# EAGLE design MATE_2024_float_layer_cake_footprint_v1 (EAGLE 9.6.2)
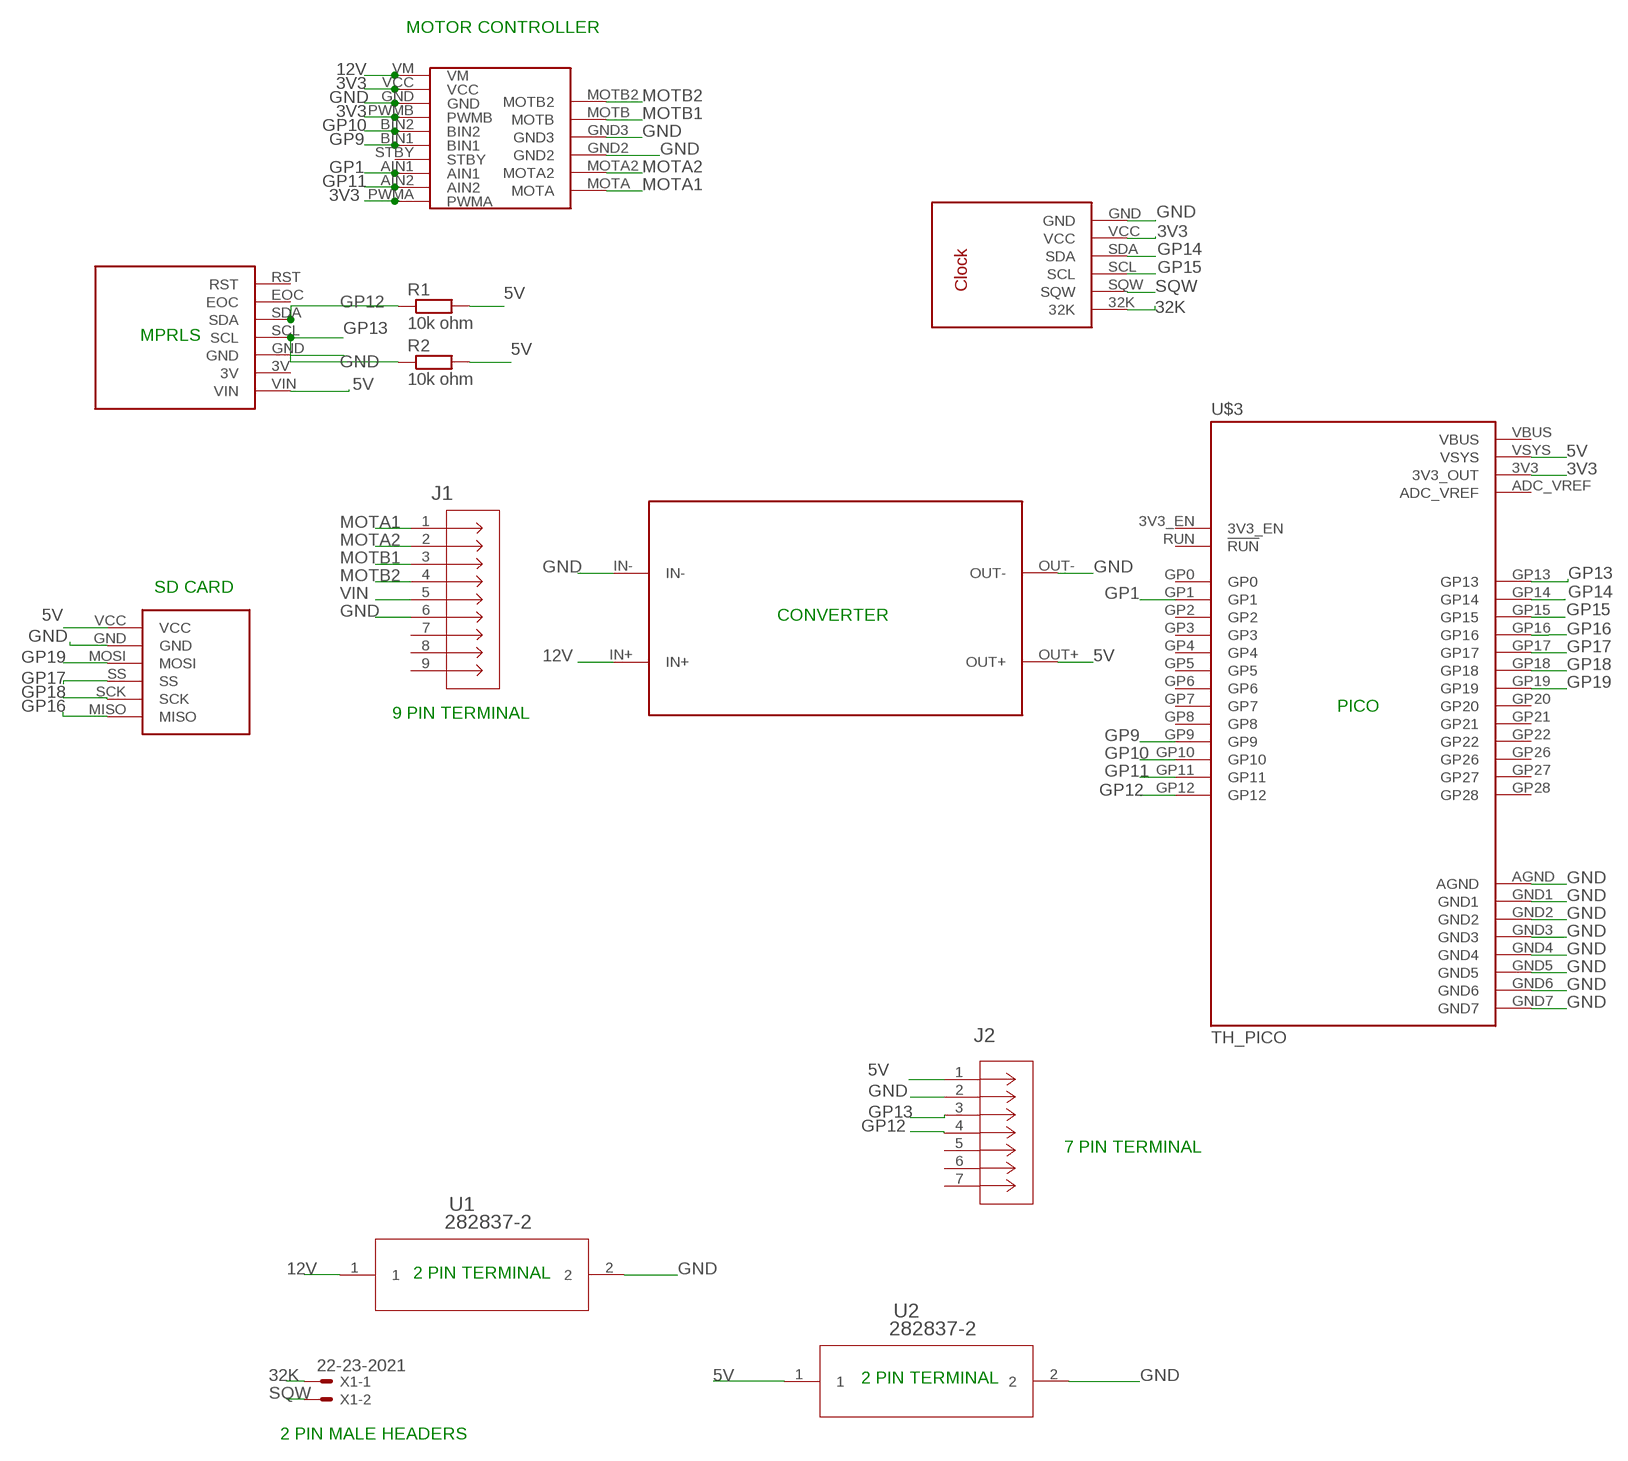
[diagram p0: schematic, sheet 1]

## Parts
J1  282837-9  [CONN9_282837-9_TEC]
J2  282837-7  [282837-7_TEC]
PRESSURE  PRESSURE  [PRESSURE]
R1  10k ohm  R-EU_0204/7  [0204/7]
R2  10k ohm  R-EU_0204/7  [0204/7]
U1  282837-2  [282837-2_TYC]
U2  282837-2  [282837-2_TYC]
U$1  CONVERTER  [CONVERTER]
U$2  STEPPERMOTOR  [STEPPERV2]
U$3  TH_PICO  [TH_PICO]
U$5  MICROSDCARD  [MICROSDCARD]
U$6  CLOCKMODULE  [CLOCKMODULE]
X1  22-23-2021  [22-23-2021]

## Nets
3V3: U$2.PWMA U$2.PWMB U$2.VCC U$3.3V3(3V3_OUT) U$6.VCC
5V: J2.1 PRESSURE.VIN R1.2 R2.2 U2.1 U$1.OUT+ U$3.VSYS U$5.VCC
12V: U1.1 U$1.IN+ U$2.VM
32K: U$6.32K X1.1
GND: J1.6 J2.2 PRESSURE.GND U1.2 U2.2 U$1.IN- U$1.OUT- U$2.GND U$2.GND2 U$2.GND3 U$3.AGND U$3.GND1 U$3.GND2 U$3.GND3 U$3.GND4 U$3.GND5 U$3.GND6 U$3.GND7 U$5.GND U$6.GND
GP1: U$2.AIN1 U$3.GP1
GP9: U$2.BIN1 U$3.GP9
GP10: U$2.BIN2 U$3.GP10
GP11: U$2.AIN2 U$3.GP11
GP12: J2.4 PRESSURE.SDA R1.1 U$3.GP12
GP13: J2.3 PRESSURE.SCL R2.1 U$3.GP13
GP14: U$3.GP14 U$6.SDA
GP15: U$3.GP15 U$6.SCL
GP16: U$3.GP16 U$5.MISO
GP17: U$3.GP17 U$5.SS
GP18: U$3.GP18 U$5.SCK
GP19: U$3.GP19 U$5.MOSI
MOTA1: J1.1 U$2.MOTA
MOTA2: J1.2 U$2.MOTA2
MOTB1: J1.3 U$2.MOTB
MOTB2: J1.4 U$2.MOTB2
SQW: U$6.SQW X1.2
VIN: J1.5
Unconnected: J1.7 J1.8 J1.9 J2.5 J2.6 J2.7 PRESSURE.3V PRESSURE.EOC PRESSURE.RST U$2.STBY U$3.3V3_EN U$3.GP0 U$3.GP2 U$3.GP3 U$3.GP4 U$3.GP5 U$3.GP6 U$3.GP7 U$3.GP8 U$3.GP20 U$3.GP21 U$3.GP22 U$3.GP26 U$3.GP27 U$3.GP28 U$3.RUN(!RUN)

## Notes on the sheet
- MOTOR CONTROLLER
- MPRLS
- SD CARD
- CONVERTER
- PICO
- 9 PIN TERMINAL
- 7 PIN TERMINAL
- 2 PIN TERMINAL
- 2 PIN TERMINAL
- 2 PIN MALE HEADERS

## Power pins joined to a net without a drawn wire
ADC_VREF: U$3.ADC_VREF
VBUS: U$3.VBUS

## Library data of the parts
J1 = float:282837-9; COPYRIGHT: Copyright (C) 2024 Ultra Librarian. All rights reserved.; MANUFACTURER_PART_NUMBER: 282837-9; MFR_NAME: TE Connectivity
J2 = float:282837-7; COPYRIGHT: Copyright (C) 2024 Ultra Librarian. All rights reserved.; MANUFACTURER_PART_NUMBER: 282837-7; MFR_NAME: TE Connectivity
PRESSURE = Pressure Sensor:PRESSURE
R1 R2 = rcl:R-EU_: RESISTOR, European symbol; SPICEPREFIX: R
U1 U2 = float:282837-2; COPYRIGHT: Copyright (C) 2024 Ultra Librarian. All rights reserved.; MANUFACTURER_PART_NUMBER: 282837-2; MFR_NAME: TE Connectivity
U$1 = float:CONVERTER
U$2 = Stepper_Motor (1):STEPPERMOTOR
U$3 = raspberryPiPico_thru-hole:TH_PICO
U$5 = SDCARD:MICROSDCARD
U$6 = Clock:CLOCKMODULE
X1 = con-molex:22-23-2021: .100" (2.54mm) Center Header - 2 Pin; MF: MOLEX; MPN: 22-23-2021; OC_FARNELL: 1462926; OC_NEWARK: 25C3832

## Board
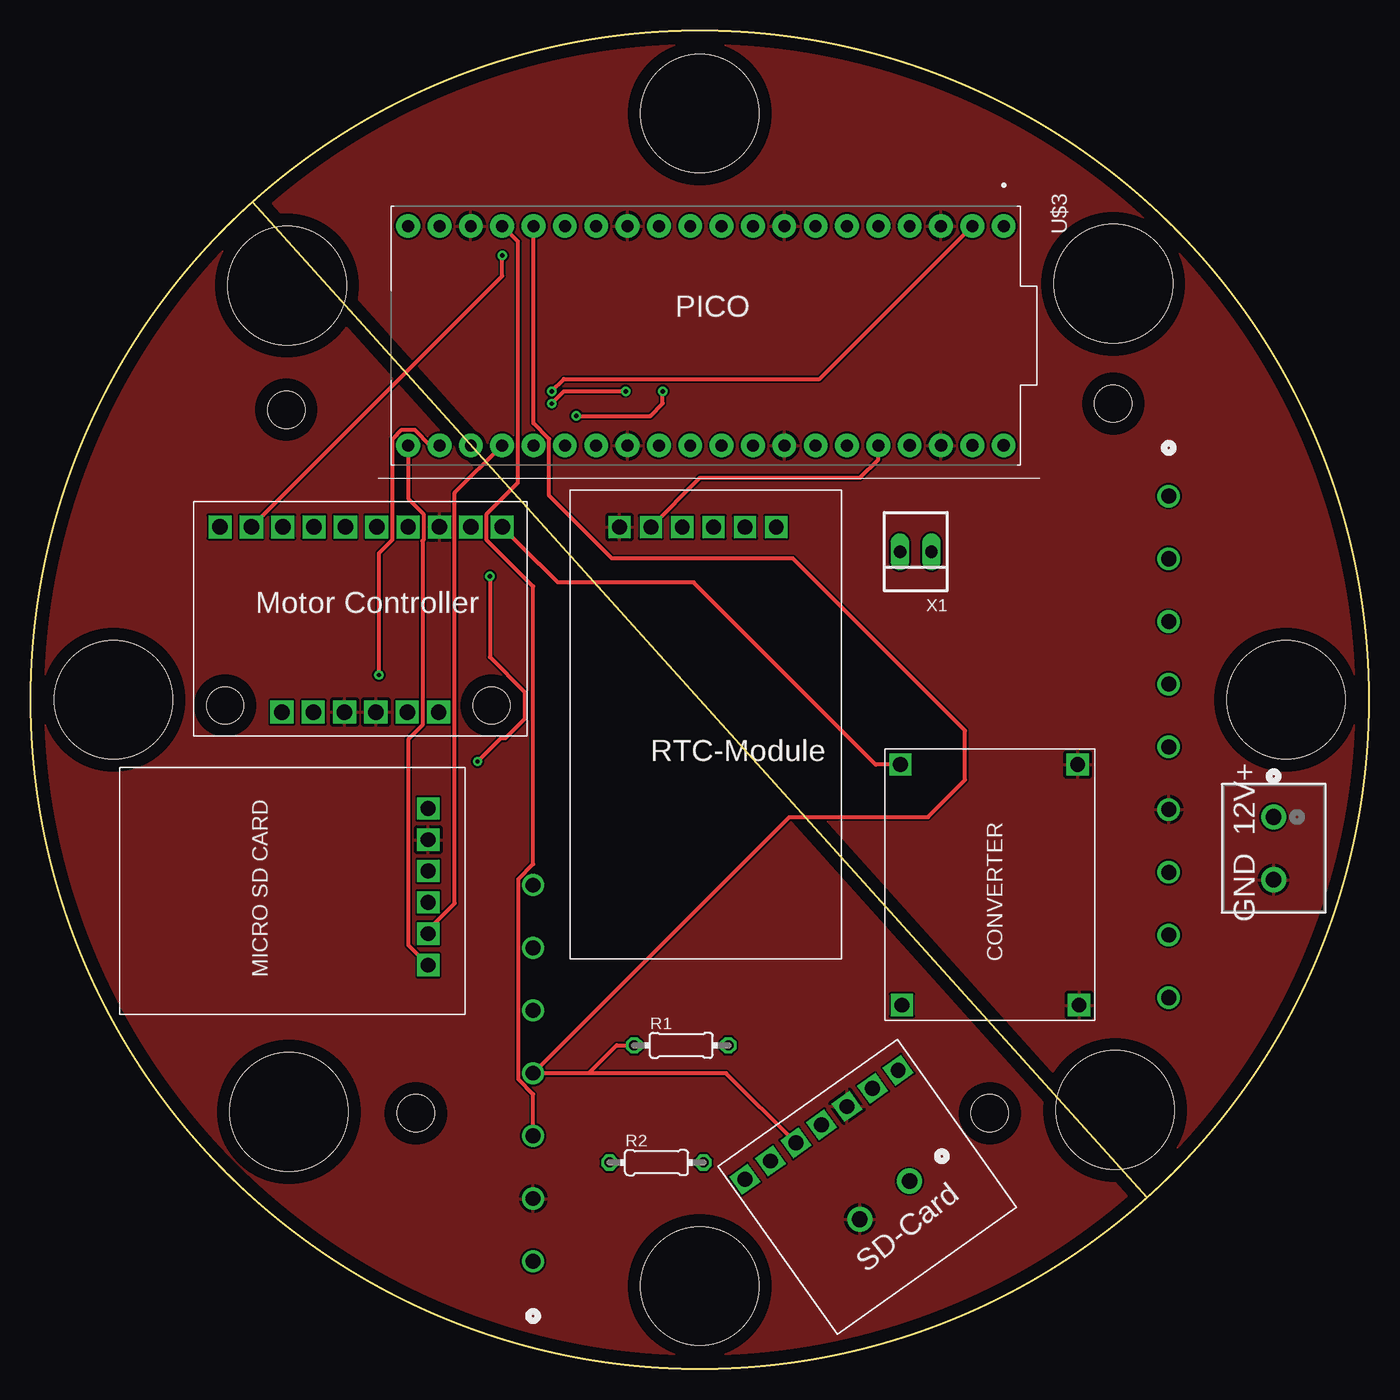
[diagram p1: board, top side]
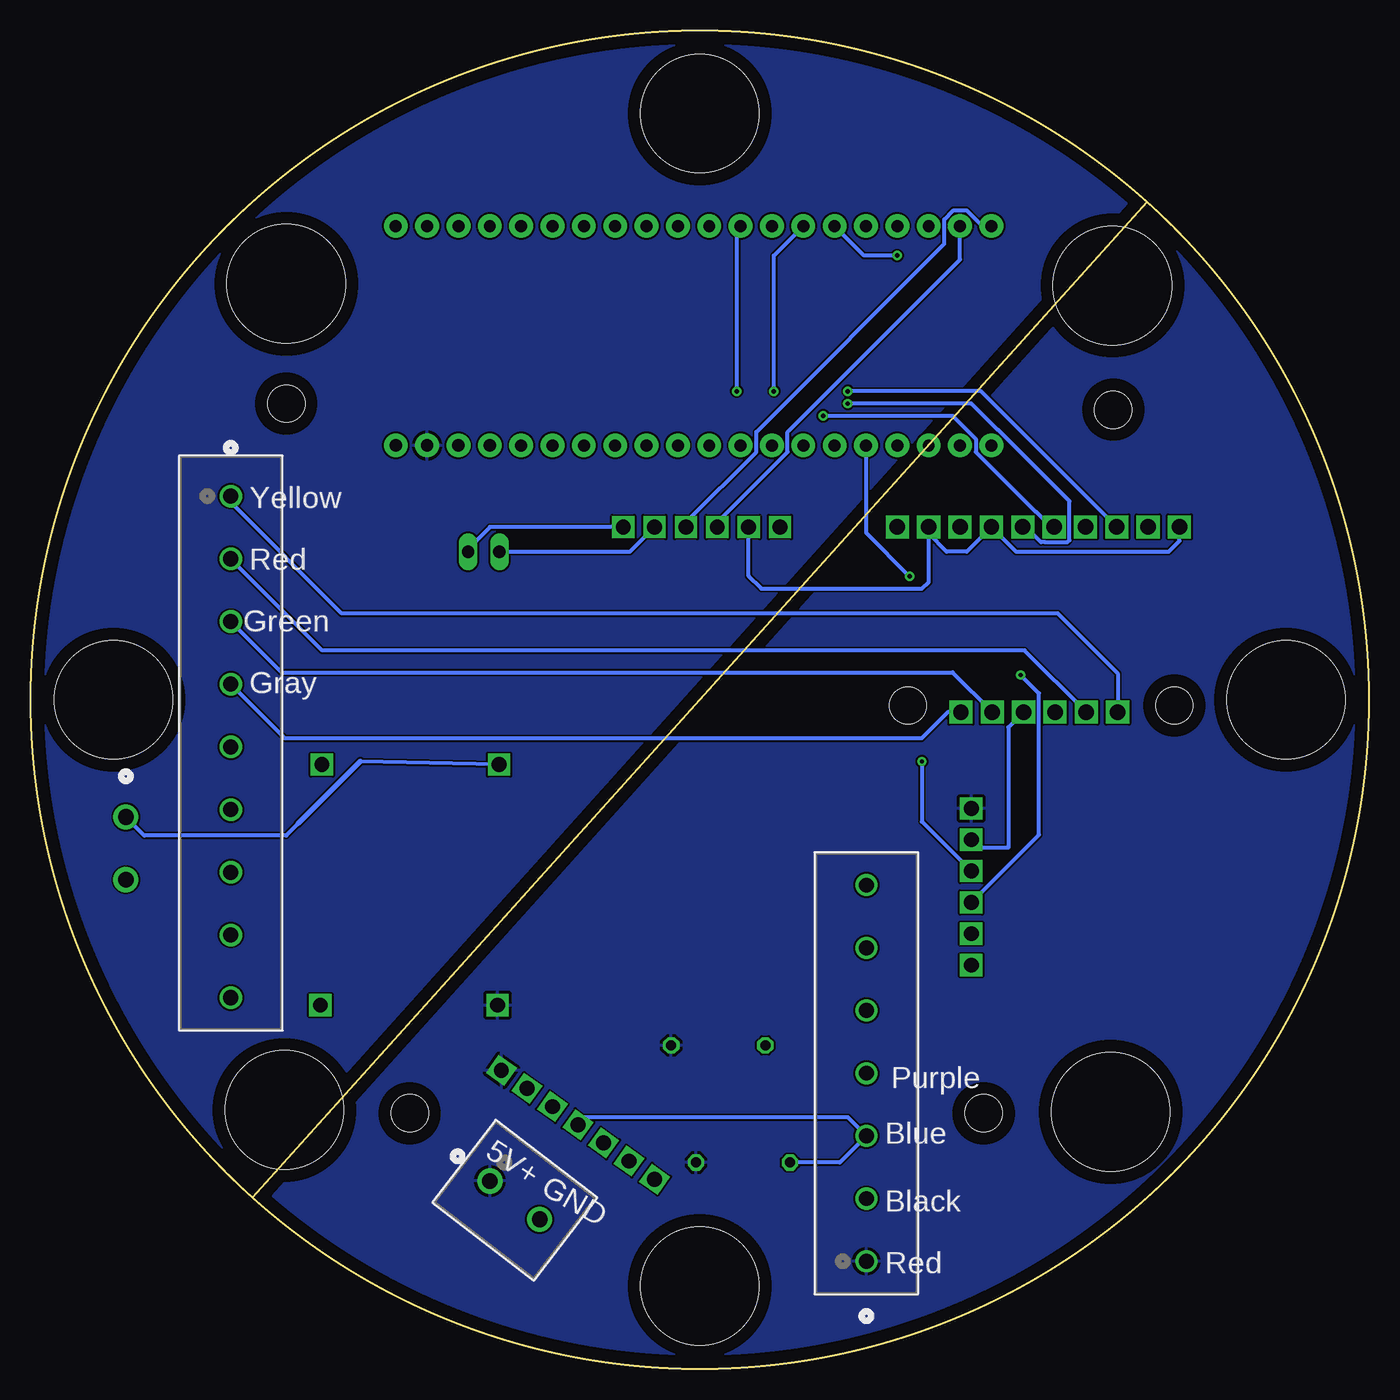
[diagram p2: board, bottom side, seen from below]

Size 108.4 x 108.4 mm. Coordinates in mm from the lower left corner, seen from the top.
Outline: circle at 54.2,54.2 radius 54.2
Copper layers (1*16): Top 0.035mm / dielectric 1.5mm / Bottom 0.035mm
Design rules "default": minimum track width 6mil, minimum drill 0.35mm, track to track 6mil, track to pad 6mil, pad to pad 6mil, via to via 6mil, smd to smd 6mil, copper to edge 40mil, drill to drill 6mil, minimum pad ring 10mil, minimum via ring 8mil, stop-mask expansion 4mil, vias tented up to drill 0mil, thermal gap 10mil
Holes 9.6 mm at 54.2,101.7 87.71,87.91 101.7,54.2 87.86,20.96 54.2,6.7 20.91,20.81 6.7,54.2 20.76,87.76
Holes 3 mm at 77.7,20.7 31.2,20.7 20.7,77.7 87.7,78.2

### Footprints (pad centres in the part's own frame; a part is rotated, then mirrored left to right if it is on the bottom)
CONN9_282837-9_TEC = drill 1.219 pad 1.727: 1 0,0; 2 5.08,0; 3 10.16,0; 4 15.24,0; 5 20.32,0; 6 25.4,0; 7 30.48,0; 8 35.56,0; 9 40.64,0
282837-7_TEC = drill 1.194 pad 1.702: 1 0,0; 2 5.08,0; 3 10.16,0; 4 15.24,0; 5 20.32,0; 6 25.4,0; 7 30.48,0
PRESSURE = drill 1.2 square: 3V 3.94,2.1; EOC 14.1,2.1; GND 6.48,2.1; RST 16.64,2.1; SCL 9.02,2.1; SDA 11.56,2.1; VIN 1.4,2.1
0204/7 = drill 0.813 octagon: 1 -3.81,0; 2 3.81,0
282837-2_TYC = drill 1.27 pad 2.032: 1 0,0; 2 5.08,0
CONVERTER = drill 1.2 square: IN+ -9.746,-5.746; IN- -9.746,8.619; OUT+ 9.746,-5.619; OUT- 9.746,8.746
STEPPERV2 = drill 1.25 square: AIN1 7.207,17; AIN2 4.667,17; BIN1 12.287,17; BIN2 14.827,17; GND 19.907,17; GND2 12.22,2; GND3 14.76,2; MOTA 7.14,2; MOTA2 9.68,2; MOTB 17.3,2; MOTB2 19.84,2; PWMA 2.127,17; PWMB 17.367,17; STBY 9.747,17; VCC 22.447,17; VM 24.987,17 | hole 3: 24.13,2.54; 2.54,2.54
TH_PICO = drill 0.965 pad 1.93: 3V3 8.89,13.97; ADC_VREF 8.89,11.43; AGND 8.89,6.35; GND1 -8.89,19.05; GND2 -8.89,6.35; GND3 -8.89,-6.35; GND4 -8.89,-19.05; GND5 8.89,-19.05; GND6 8.89,-6.35; GP0 -8.89,24.13; GP1 -8.89,21.59; GP2 -8.89,16.51; GP3 -8.89,13.97; GP4 -8.89,11.43; GP5 -8.89,8.89; GP6 -8.89,3.81; GP7 -8.89,1.27; GP8 -8.89,-1.27; GP9 -8.89,-3.81; GP10 -8.89,-8.89; GP11 -8.89,-11.43; GP12 -8.89,-13.97; GP13 -8.89,-16.51; GP14 -8.89,-21.59; GP15 -8.89,-24.13; GP16 8.89,-24.13; GP17 8.89,-21.59; GP18 8.89,-16.51; GP19 8.89,-13.97; GP20 8.89,-11.43; GP21 8.89,-8.89; GP22 8.89,-3.81; GP26 8.89,1.27; GP27 8.89,3.81; GP28 8.89,8.89; RUN 8.89,-1.27 | drill 1 pad 1.93: 3V3_EN 8.89,16.51; GND7 8.89,19.05; VBUS 8.89,24.13; VSYS 8.89,21.59
MICROSDCARD = drill 1.2 square: GND 4.16,3; MISO -6,3; MOSI 1.62,3; SCK -3.46,3; SS -0.92,3; VCC 6.7,3
CLOCKMODULE = drill 1.2 square: 32K 3,16.7; GND 3,4; SCL 3,11.62; SDA 3,9.08; SQW 3,14.16; VCC 3,6.54
22-23-2021 = drill 1 long: 1 -1.27,0; 2 1.27,0

### Placement (x,y rotation side)
J1  92.2,70.7 270 bottom
J2  40.7,8.7 90 bottom
PRESSURE  70.2,26.7 215.4 top
R1  52.7,26.2 0 top
R2  50.7,16.7 0 top
U1  100.7,44.7 270 top
U2  71.2,15.2 322.5 bottom
U$1  76.2,39.2 270 top
U$2  13.2,51.2 0 top
U$3  54.7,83.7 270 top
U$5  35.2,38.7 90 top
U$6  43.7,71.2 270 top
X1  71.7,66.2 180 top

### Tracks (layer width: path | path; a pad name or v marks a point on that pad's centre or on a via)
3V3
  Top 0.305: U$6.VCC 54.24,72.2 67.2,72.2 68.67,73.67 U$3.3V3
  Bottom 0.305: U$6.VCC 50.24,64.24 49.2,63.2 36.2,63.2 35.65,63.75 U$2.VCC 35.65,67.65 34.2,66.2 32.57,66.2 U$2.PWMB 28.57,66.2 16.2,66.2 15.33,67.07 U$2.PWMA
5V
  pour Bottom: 54.2,109.7 31.2,109.7 -5.8,72.7 -5.8,37.2 33.2,-1.8 75.2,-1.8 109.7,32.7 109.7,75.2 109.2,75.7 75.7,109.2 60.7,109.2
12V
  Top 0.305: U$1.IN+ 68.45,48.95 53.7,63.7 42.7,63.7 41.2,65.2 41.19,65.2 U$2.VM
  Bottom 0.305: U$1.IN+ 81.7,49.2 | 86.74,44.16 87.7,43.2 99.2,43.2 U1.1
  Bottom 0.406: 81.7,49.2 86.74,44.16
32K
  Bottom 0.305: U$6.32K 71.2,68.2 72.97,66.43 X1.1
GND
  Bottom 0.305: U$2.GND3 29.2,51.96 29.2,42.2 31.54,42.2 U$5.GND
  pour Top: 52.2,109.7 32.2,109.7 -5.3,72.2 -5.3,36.2 35.2,-4.3 73.7,-4.3 109.7,31.7 109.7,75.7 77.7,107.7 76.2,109.2 59.7,109.2
GP1  (via drill 0.35)
  Top 0.305: U$3.GP1 63.9,80.2 43.2,80.2 v42.2,79.2
  Bottom 0.305: v42.2,79.2 31.41,79.2 U$2.AIN1
GP9  (via drill 0.35)
  Top 0.305: v44.2,77.2 50.2,77.2 51.2,78.2 v51.2,79.2
  Bottom 0.305: v44.2,77.2 33.7,77.2 31.84,75.34 31.84,74.28 27,69.44 26.96,69.44 25.72,68.2 U$2.BIN1 | v51.2,79.2 51.2,92.28 U$3.GP9
GP10  (via drill 0.35)
  Top 0.305: v42.2,78.2 43.2,79.2 v48.2,79.2
  Bottom 0.305: v42.2,78.2 32.2,78.2 30.08,76.08 30.04,76.08 24.25,70.28 24.25,67.14 24.42,66.96 26.2,66.96 26.55,66.96 27.79,68.2 U$2.BIN2 | v48.2,79.2 48.2,90.2 U$3.GP10
GP11  (via drill 0.35)
  Top 0.305: v38.2,90.2 38.2,88.53 U$2.AIN2
  Bottom 0.305: v38.2,90.2 40.88,90.2 U$3.GP11
GP12
  Top 0.305: PRESSURE.SDA 56.35,23.94 45.2,23.94 | 45.2,23.94 J2.4 61.46,44.7 72.7,44.7 75.7,47.7 75.7,51.7 61.74,65.66 47.09,65.66 42,70.74 42,75.34 40.73,76.61 U$3.GP12 | 45.2,23.94 47.46,26.2 R1.1
GP13
  Top 0.305: J2.3 40.7,22.24 39.5,23.44 39.5,39.68 40.7,40.88 40.7,63.38 36.95,67.14 36.95,69.26 39.46,71.78 39.46,91.32 U$3.GP13
  Bottom 0.305: PRESSURE.SCL 63.46,20.37 42.21,20.37 J2.3 42.86,16.7 R2.1
GP14
  Bottom 0.305: U$3.GP14 33.11,89.87 47.08,75.9 47.08,74.28 52.78,68.58 U$6.SDA
GP15
  Bottom 0.305: U$6.SCL 55.32,68.58 49.62,74.28 49.62,75.9 34.38,91.14 34.38,93.12 33.64,93.86 32.58,93.86 31.31,92.59 U$3.GP15
GP16
  Top 0.305: U$5.MISO 30.57,34.33 30.57,50.96 31.74,52.14 31.74,67.07 31.81,67.14 31.81,69.26 30.57,70.5 U$3.GP16
GP17  (via drill 0.35)
  Top 0.305: v28.2,56.2 28.2,66.07 29.3,67.17 29.3,75.34 30.04,76.08 31.1,76.08 32.37,74.81 U$3.GP17
  Bottom 0.305: U$5.SS 26.72,43.26 26.72,54.72 v28.2,56.2
GP18
  Top 0.305: U$5.SCK 32.2,35.55 34.35,37.7 34.35,70.97 U$3.GP18
GP19  (via drill 0.35)
  Top 0.305: v37.2,64.2 37.2,57.64 40,54.85 40,52.64 38.44,51.07 38.07,51.07 v36.2,49.2
  Bottom 0.305: U$3.GP19 40.73,67.73 v37.2,64.2 | U$5.MOSI 36.2,44.32 v36.2,49.2
MOTA1
  Bottom 0.305: J1.1 92.2,70.2 83.2,61.2 25.2,61.2 20.34,56.34 U$2.MOTA
MOTA2
  Bottom 0.305: J1.2 84.78,58.2 27.88,58.2 U$2.MOTA2
MOTB1
  Bottom 0.305: J1.3 88.07,56.41 33.71,56.41 U$2.MOTB
MOTB2
  Bottom 0.305: J1.4 87.81,51.07 36.23,51.07 34.1,53.2 U$2.MOTB2
SQW
  Bottom 0.305: X1.2 59.86,66.2 U$6.SQW

### Text on the board
tNames: PICO | Motor Controller | RTC-Module | 12V+ | GND | SD-Card
bNames: Yellow | Red | Green | Gray | Purple | Blue | 5V+ | GND | Black | Red